# EAGLE design fonte-1 (EAGLE 6.4)
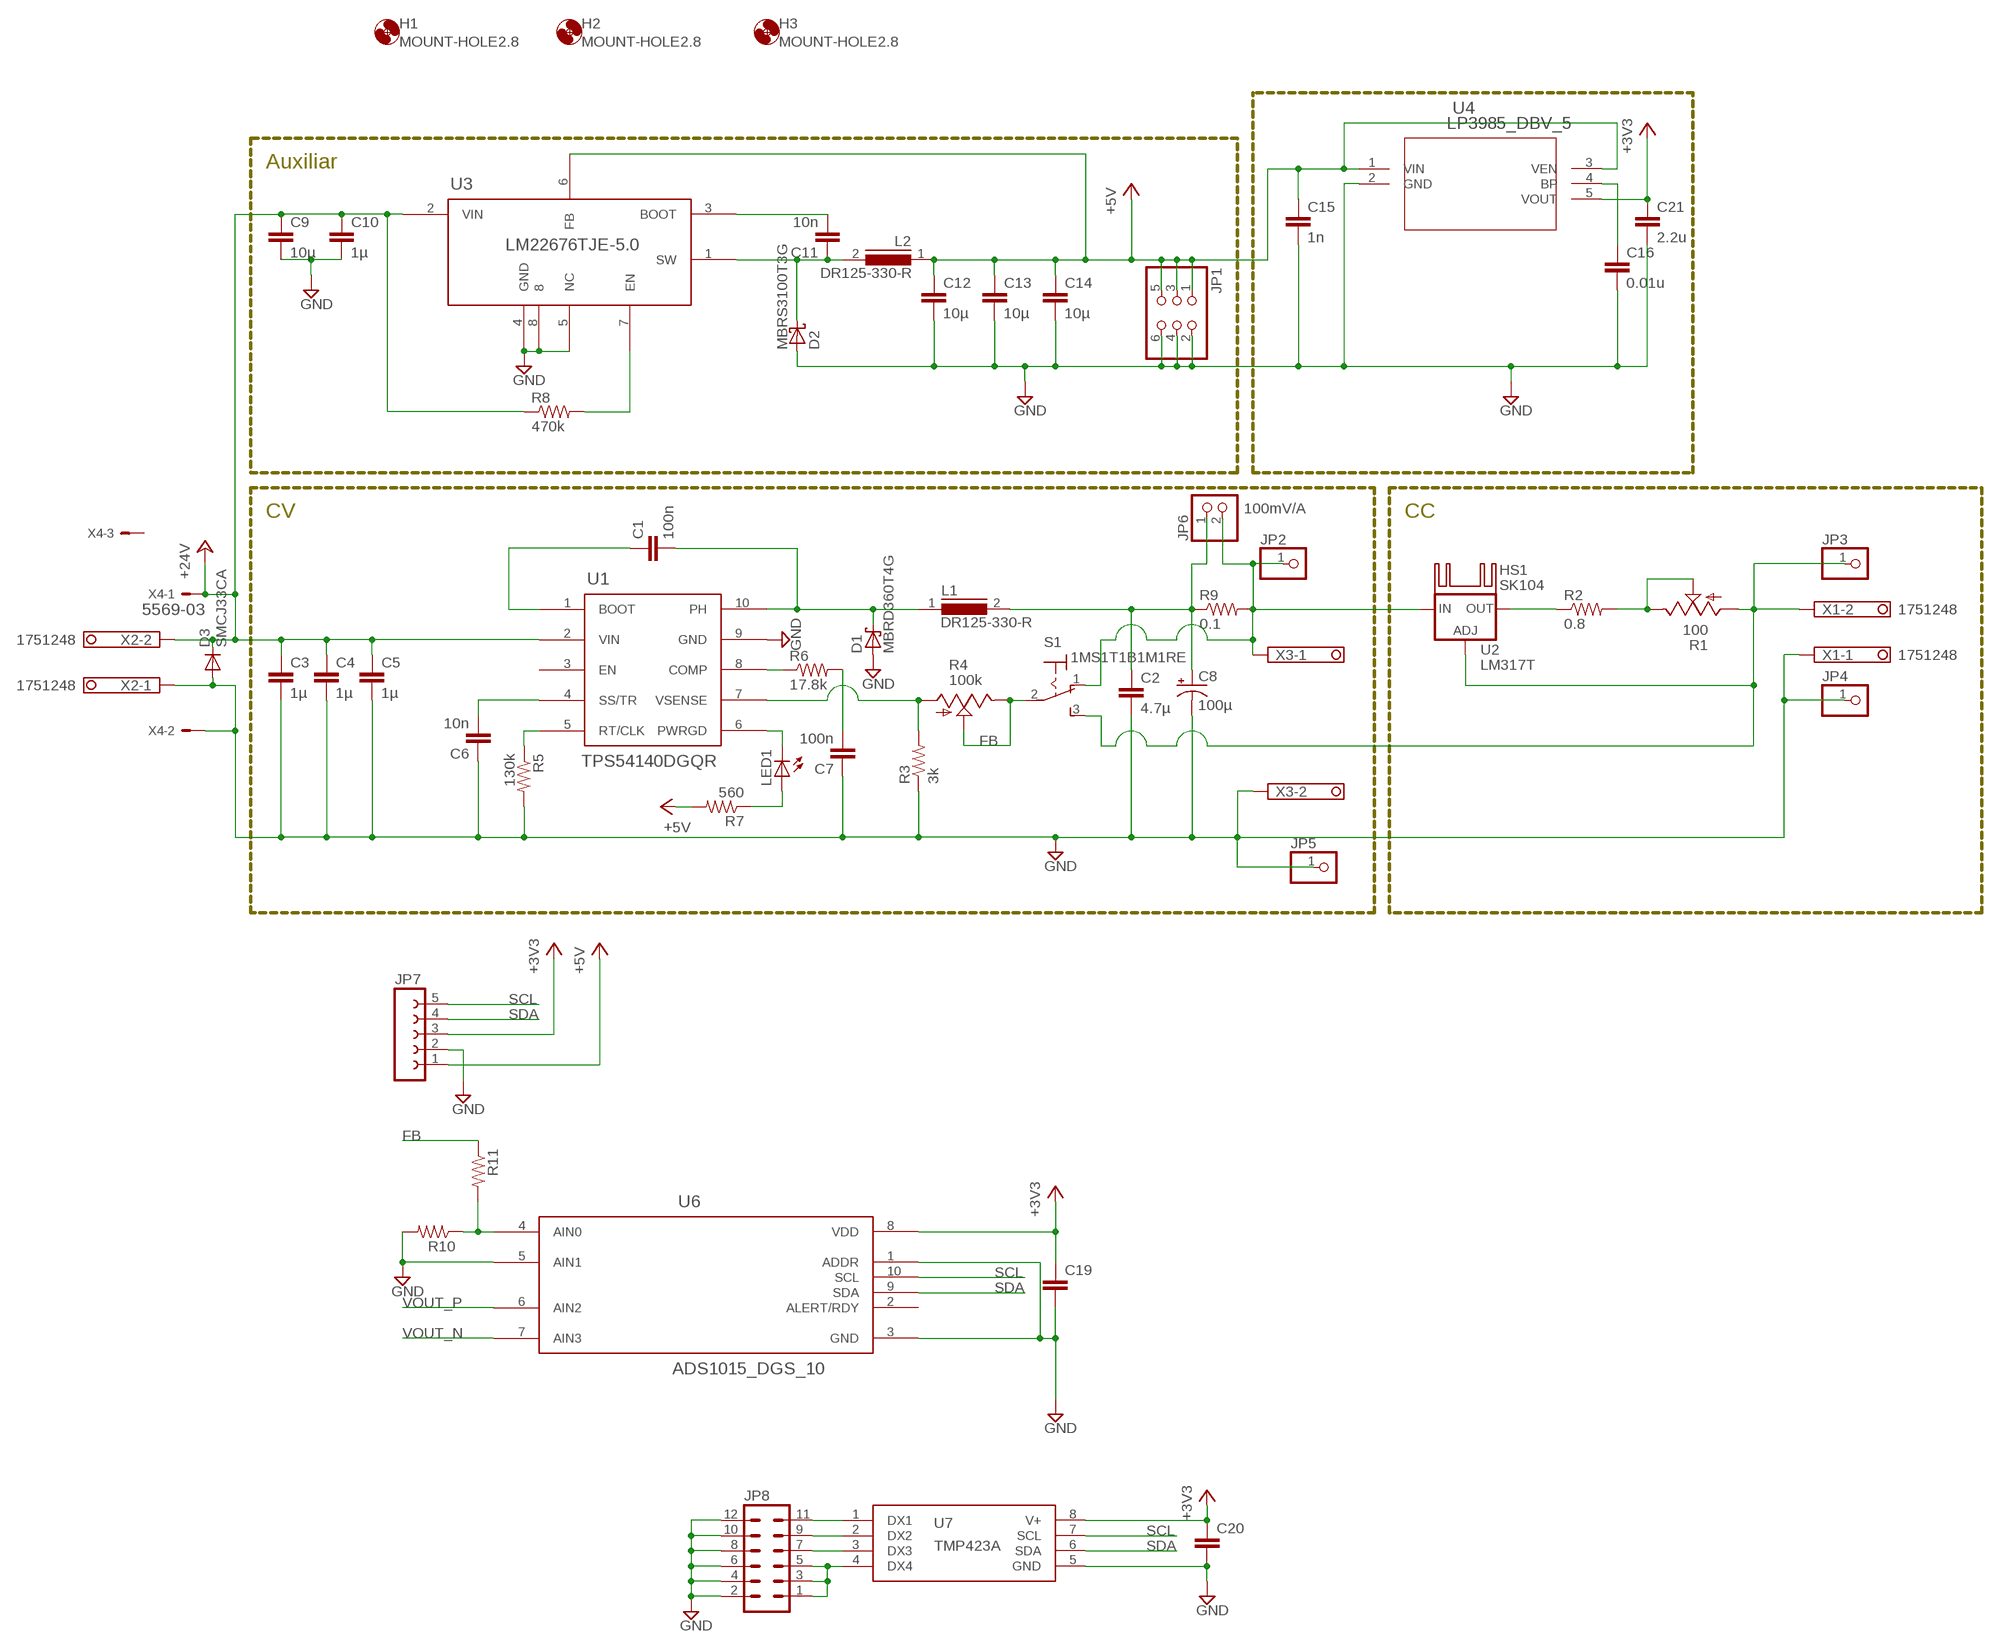
[diagram p0: schematic, sheet 1]

## Parts
C1  100n  C-EUC0805  [C0805]
C2  4.7µ  C-EUC1210  [C1210]
C3  1µ  C-EUC1206  [C1206]
C4  1µ  C-EUC1206  [C1206]
C5  1µ  C-EUC1206  [C1206]
C6  10n  C-EUC0805  [C0805]
C7  100n  C-EUC0805  [C0805]
C8  100µ  CPOL-USUD-8X10  [UD-8X10_NICHICON]
C9  10µ  C-EUC2220K  [C2220K]
C10  1µ  C-EUC1206  [C1206]
C11  10n  C-EUC0805  [C0805]
C12  10µ  C-EUC1206  [C1206]
C13  10µ  C-EUC1206  [C1206]
C14  10µ  C-EUC1206  [C1206]
C15  1n  C-EUC0805  [C0805]
C16  0.01u  C-EUC0805  [C0805]
C19  C-EUC0805  [C0805]
C20  C-EUC1206  [C1206]
C21  2.2u  C-EUC0805  [C0805]
D1  MBRD360T4G  [DPACK_1]
D2  MBRS3100T3G  SCHOTTKY-DIODESMC  [SMC]
D3  SMCJ33CA  DIODE-SMC  [SMC]
H1  MOUNT-HOLE2.8  [2,8]
H2  MOUNT-HOLE2.8  [2,8]
H3  MOUNT-HOLE2.8  [2,8]
HS1  SK104  [SK104]
JP1  PINHD-2X3  [2X03]
JP2  PINHD-1X1  [1X01]
JP3  PINHD-1X1  [1X01]
JP4  PINHD-1X1  [1X01]
JP5  PINHD-1X1  [1X01]
JP6  100mV/A  PINHD-1X2  [1X02]
JP7  FE05-1  [FE05-1]
JP8  MA06-2  [MA06-2]
L1  DR125-330-R  DR125  [DR125]
L2  DR125-330-R  DR125  [DR125]
LED1  LED5MM  [LED5MM]
R1  100  TRIM_US-  [1X03]
R2  0.8  R-US_R2512  [R2512]
R3  3k  R-US_R0805  [R0805]
R4  100k  TRIM_US-  [1X03]
R5  130k  R-US_R0805  [R0805]
R6  17.8k  R-US_R0805  [R0805]
R7  560  R-US_R0805  [R0805]
R8  470k  R-US_R0805  [R0805]
R9  0.1  R-US_R2010  [R2010]
R10  R-US_R0805  [R0805]
R11  R-US_R0805  [R0805]
S1  1MS1T1B1M1RE  M9040P  [M9040P]
U1  TPS54140DGQR  TPS54140_DGQ_10  [DGQ10_1P88X1P57]
U2  LM317T  LM317TS  [317TS]
U3  LM22676TJE-5.0  LM22678_NDR_7  [TJ7A]
U4  LP3985_DBV_5  [MF05A]
U6  ADS1015_DGS_10  [DGS10]
U7  TMP423A  TMP422AIDC*  [SOT23-8]
X1  1751248  [1751248]
X2  1751248  [1751248]
X3  1751248  [1751248]
X4  5569-03  [5569-03]

## Nets
+3V3: C19.1 C20.1 C21.1 JP7.3 U4.5(VOUT) U6.8(VDD) U7.8(V+)
+5V: C12.1 C13.1 C14.1 C15.1 JP1.1 JP1.3 JP1.5 JP7.1 L2.1 R7.2 U3.6(FB) U4.1(VIN) U4.3(VEN)
+24V: C3.1 C4.1 C5.1 C9.1 C10.1 D3.C R8.1 U1.2(VIN) U3.2(VIN) X2.2 X4.1
FB [+24V]: R4.2(S) R4.3(E) R11.1 S1.2(P)
GND: C2.2 C3.2 C4.2 C5.2 C6.1 C7.1 C8.- C9.2 C10.2 C12.2 C13.2 C14.2 C15.2 C16.2 C19.2 C20.2 C21.2 D1.A1(A) D1.A2(A) D2.A D3.A JP1.2 JP1.4 JP1.6 JP4.1 JP5.1 JP7.2 JP8.2 JP8.4 JP8.6 JP8.8 JP8.10 JP8.12 R3.1 R5.2 R10.2 U1.9(GND) U3.4(GND) U3.5(NC) U3.8 U4.2(GND) U6.1(ADDR) U6.3(GND) U6.5(AIN1) U7.5(GND) X1.1 X2.1 X3.2 X4.2
N$1: C1.2 D1.K(C) L1.1 U1.10(PH)
N$2: C1.1 U1.1(BOOT)
N$3 [+24V]: R1.2(S) R1.3(E) R2.2
N$4: R8.2 U3.7(EN)
N$5: R10.1 R11.2 U6.4(AIN0)
N$6 [+24V]: R2.1 U2.2(OUT)
N$7: R3.2 R4.1(A) U1.7(VSENSE)
N$8: JP8.1 JP8.3 JP8.5 U7.4(DX4)
N$9: R5.1 U1.5(RT/CLK)
N$10: C6.2 U1.4(SS/TR)
N$11: R6.1 U1.8(COMP)
N$12: C7.2 R6.2
N$13: LED1.K(C) U1.6(PWRGD)
N$14: LED1.A R7.1
N$15: C16.1 U4.4(BP)
N$16: C11.1 D2.C L2.2 U3.1(SW)
N$17: JP8.7 U7.3(DX3)
N$18: C11.2 U3.3(BOOT)
N$19: JP8.9 U7.2(DX2)
N$20: JP8.11 U7.1(DX1)
SCL: JP7.5 U6.10(SCL) U7.7(SCL)
SDA: JP7.4 U6.9(SDA) U7.6(SDA)
VOUT_CC [+24V]: JP3.1 R1.1(A) S1.3(S) U2.1(ADJ) X1.2
VOUT_N [+24V]: JP2.1 JP6.2 R9.2 S1.1(O) U2.3(IN) U6.7(AIN3) X3.1
VOUT_P [+24V]: C2.1 C8.+ JP6.1 L1.2 R9.1 U6.6(AIN2)
Unconnected: U1.3(EN) U6.2(ALERT/RDY) X4.3

## Notes on the sheet
- Auxiliar
- CV | CC

## Library data of the parts
C1-C7 C9-C16 C19-C21 = rcl:C-EU: CAPACITOR, European symbol
C8 = rcl:CPOL-US: POLARIZED CAPACITOR, American symbol
D1 = diode:MBRD360T4G
D2 = diode:SCHOTTKY-DIODE: Schottky Diode
D3 = diode:DIODE-: DIODE
H1-H3 = holes:MOUNT-HOLE: MOUNTING HOLE with drill center marker
HS1 = heatsink:SK104: HEATSINK manufacturer Fischer/distributor Buerklin
JP1 = pinhead:PINHD-2X3: PIN HEADER
JP2-JP5 = pinhead:PINHD-1X1: PIN HEADER
JP6 = pinhead:PINHD-1X2: PIN HEADER
JP7 = con-lsta:FE05-1: FEMALE HEADER; OC_FARNELL: unknown; OC_NEWARK: unknown
JP8 = con-lstb:MA06-2: PIN HEADER; OC_FARNELL: unknown; OC_NEWARK: unknown
L1 L2 = inductors:DR125: High Power Density, High Efficiency, Shielded Inductors Source: coiltronics_dr_series.pdf
LED1 = led:LED: LED OSRAM: - CHIPLED LG R971, LG N971, LY N971, LG Q971, LY Q971, LO R971, LY R971 LH N974, LH R974 LS Q976, LO Q976, LY Q976 LO Q996 - Hyper CHIPLED LW Q18S LB Q993, LB Q99A, LB R99A - SideLED LS A670, LO A670, LY A670, LG A670, LP A670 LB A673, LV A673, LT A673, LW A673 LH A674 LY A675 LS A676, LA A676, LO A676, LY A676, LW A676 LS A679, LY A679, LG A679 - Hyper Micro SIDELED® LS Y876, LA Y876, LO Y876, LY Y876 LT Y87S - SmartLED LW L88C, LW L88S LB L89C, LB L89S, LG L890 LS L89K, LO L89K, LY L89K LS L896, LA L896, LO L896, LY L896 - TOPLED LS T670, LO T670, LY T670, LG T670, LP T670 LSG T670, LSP T670, LSY T670, LOP T670, LYG T670 LG T671, LOG T671, LSG T671 LB T673, LV T673, LT T673, LW T673 LH T674 LS T676, LA T676, LO T676, LY T676, LB T676, LH T676, LSB T676, LW T676 LB T67C, LV T67C, LT T67C, LS T67K, LO T67K, LY T67K, LW E67C LS E67B, LA E67B, LO E67B, LY E67B, LB E67C, LV E67C, LT E67C LW T67C LS T679, LY T679, LG T679 LS T770, LO T770, LY T770, LG T770, LP T770 LB T773, LV T773, LT T773, LW T773 LH T774 LS E675, LA E675, LY E675, LS T675 LS T776, LA T776, LO T776, LY T776, LB T776 LHGB T686 LT T68C, LB T68C - Hyper Mini TOPLED® LB M676 - Mini TOPLED Santana® LG M470 LS M47K, LO M47K, LY M47K Source: http://www.osram.convergy.de LUXEON: - LUMILED® LXK2-PW12-R00, LXK2-PW12-S00, LXK2-PW14-U00, LXK2-PW14-V00 LXK2-PM12-R00, LXK2-PM12-S00, LXK2-PM14-U00 LXK2-PE12-Q00, LXK2-PE12-R00, LXK2-PE12-S00, LXK2-PE14-T00, LXK2-PE14-U00 LXK2-PB12-K00, LXK2-PB12-L00, LXK2-PB12-M00, LXK2-PB14-N00, LXK2-PB14-P00, LXK2-PB14-Q00 LXK2-PR12-L00, LXK2-PR12-M00, LXK2-PR14-Q00, LXK2-PR14-R00 LXK2-PD12-Q00, LXK2-PD12-R00, LXK2-PD12-S00 LXK2-PH12-R00, LXK2-PH12-S00 LXK2-PL12-P00, LXK2-PL12-Q00, LXK2-PL12-R00 Source: www.luxeon.com KINGBRIGHT: KA-3528ASYC Source: www.kingbright.com
R1 R4 = pot_header:TRIM_US-: POTENTIOMETER
R2 R3 R5-R11 = rcl:R-US_: RESISTOR, American symbol
S1 = switch:M9040P: TOGGLE SWITCH Marquardt
U1 = TPS54140:TPS54140_DGQ_10; DATASHEETURL: http://www.ti.com/lit/gpn/TPS54140; DESCRIPTION: 3.5V to 42V Input, 1.5A Step-Down Converter with Eco-Mode; FAMILY_NAME: STEP-DOWN REGULATOR; GENERIC_PART_NUMBER: TPS54140; INDUSTRY_STD_PKG_TYPE: MSOP-PowerPAD; MANUFACTURER: Texas Instruments; MANUFACTURER_PART_NUMBER: tps54140_dgq_10; PACKAGE_DESIGNATOR: DGQ; PIN_COUNT: 10; VENDOR: Texas Instruments
U2 = v-reg:LM317TS: VOLTAGE REGULATOR
U3 = LM22678:LM22678_NDR_7; BASEPN: LM22678; DATASHEETURL: http://www.ti.com/lit/ds/symlink/lm22678.pdf; DESCRIPTION: 5A SIMPLE SWITCHER®, Step-Down Voltage Regulator with Precision Enable; MANUFACTURER: Texas Instruments; MANUFACTURER_PART_NUMBER: lm22678_ndr_7; NSC_PACKAGEREFERENCE: TJ7A; VENDOR: Texas Instruments
U4 = LP3985:LP3985_DBV_5; BASE_PN: LP3985; COMP: TypeLDO; LIBRARY: ReferenceLP3985IM5; PARTNUMBER: LP3985IM5-25; PIN: Count5; SYMBOL: NameLP3985IM5-25; TYPE: LP3985IM5-2.5; VENDOR: NationalSemiconductor; VERSION: 1
U6 = ADS1015:ADS1015_DGS_10; DATASHEETURL: http://www.ti.com/lit/gpn/ADS1015; DESCRIPTION: 12-Bit ADC with Integrated MUX, PGA, Comparator, Oscillator, and Reference; FAMILY_NAME: PRECISION ADC (<=10MSPS); GENERIC_PART_NUMBER: ADS1015; INDUSTRY_STD_PKG_TYPE: MSOP; MANUFACTURER: Texas Instruments; PACKAGE_DESIGNATOR: DGS; PIN_COUNT: 10
U7 = texas-1:TMP422
X1-X3 = con-phoenix-350:1751248: MKDS 1/ 2-3,5 Printklemme Nennstrom: 10 A Bemessungsspannung: 160 V Raster: 3,5 mm Polzahl: 2 Montageart: Löten Anschlussart: Schraubanschluss Anschlussrichtung vom Leiter zur Platine: 0° Source: http://eshop.phoenixcontact.com .. 1751248.pdf; OC_FARNELL: unknown; OC_NEWARK: unknown
X4 = con-molex-5569:5569-03

## Net classes
1 +24V: clearance 0.762 mm

## Board
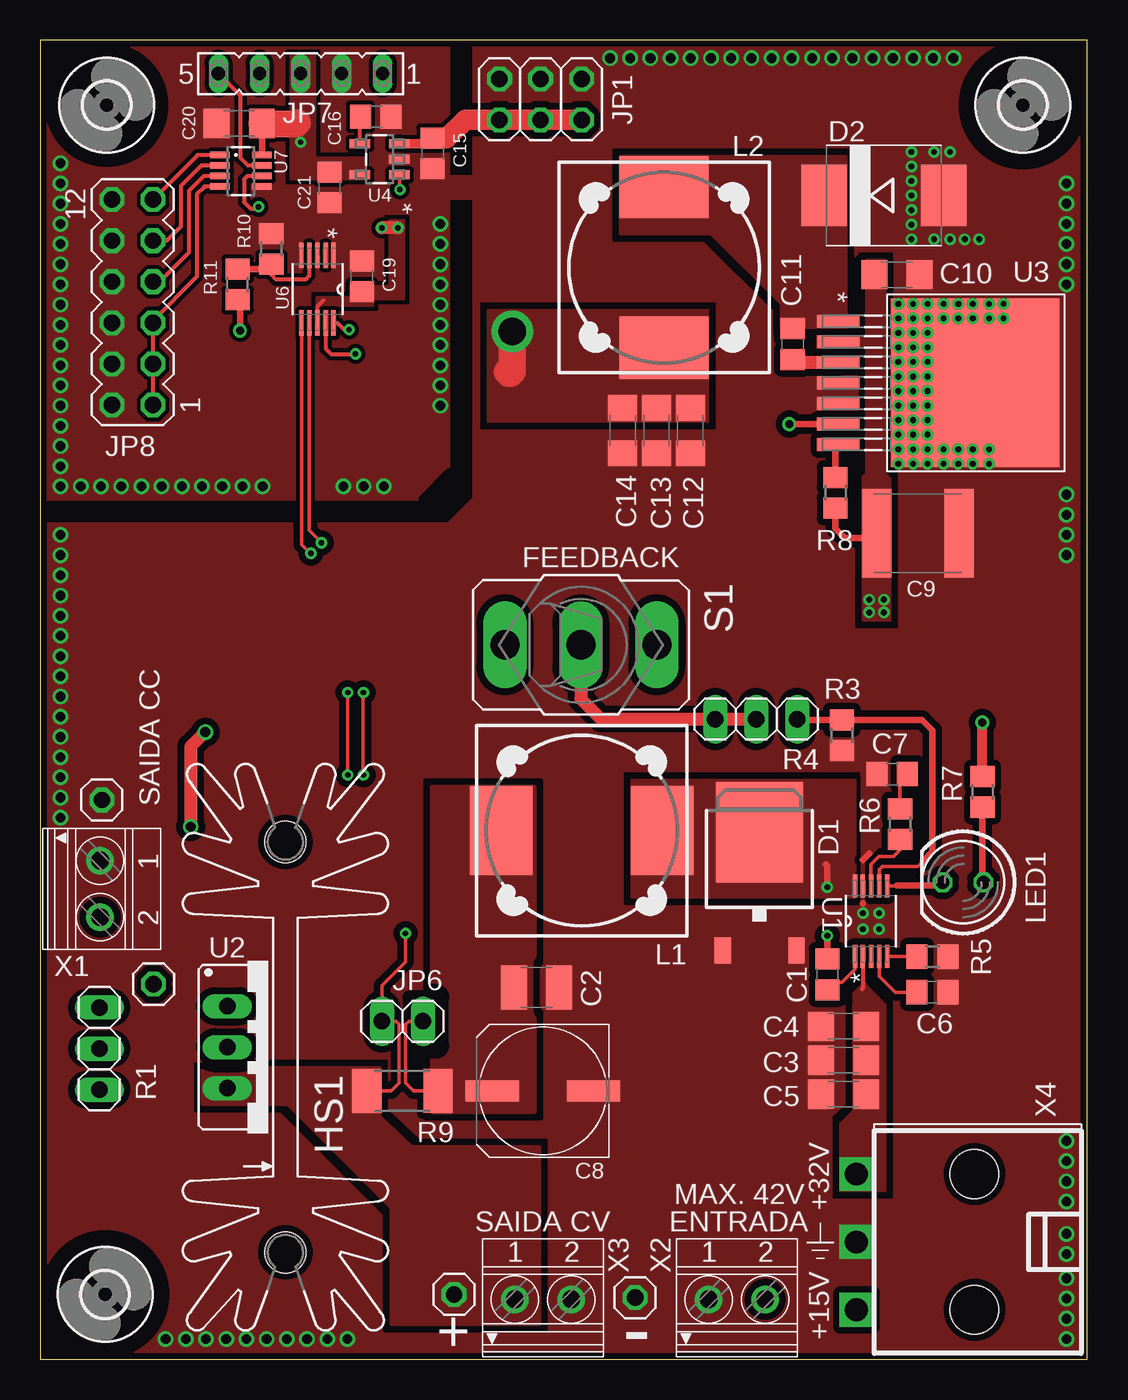
[diagram p1: board, top side]
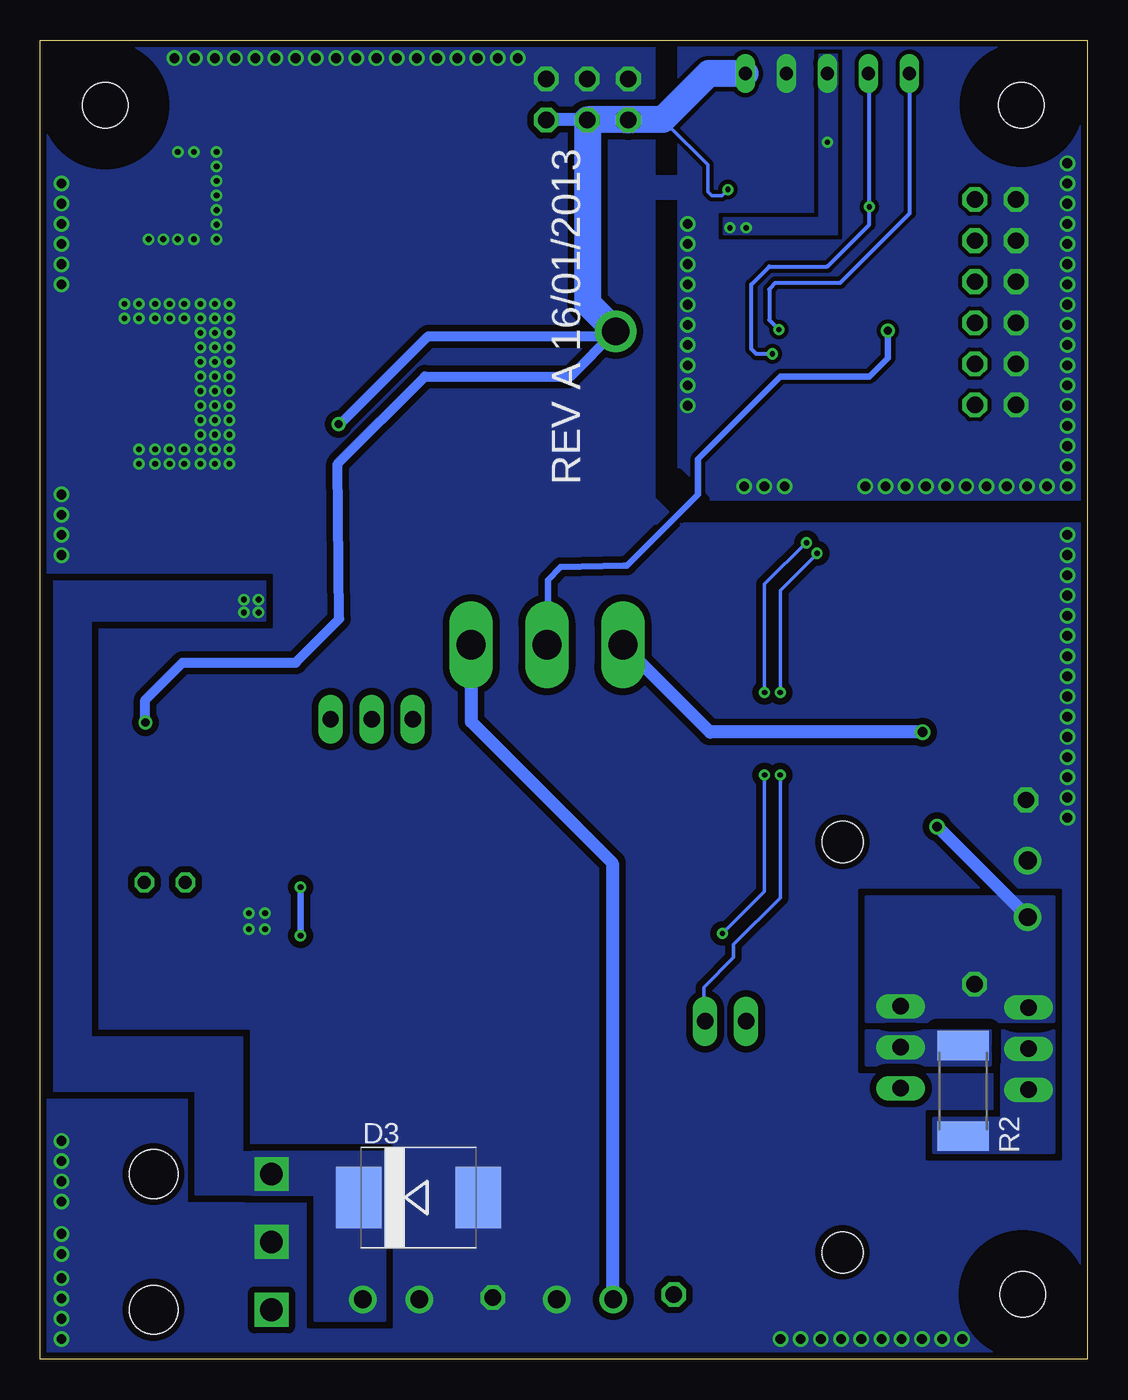
[diagram p2: board, bottom side, seen from below]

Size 64.8 x 81.6 mm. Coordinates in mm from the lower left corner, seen from the top.
Outline: 0,0 64.8,0 64.8,81.6 0,81.6 0,0
Copper layers (1*16): Top 0.0356mm / dielectric 1.5011mm / Bottom 0.0356mm
Design rules "LaenPCBOrder *": minimum track width 6mil, minimum drill 13mil, track to track 6mil, track to pad 6mil, pad to pad 6mil, via to via 6mil, smd to smd 6mil, copper to edge 15mil, drill to drill 6mil, minimum pad ring 7mil, minimum via ring 7mil, stop-mask expansion 8mil, vias tented up to drill 0mil, thermal gap 10mil
tRestrict: area 22.8,19.4 to 24.5,22.4; area 23.7,53.2 to 25.3,54.8
bRestrict: area 23.7,53.2 to 25.3,54.8

### Footprints (pad centres in the part's own frame; a part is rotated, then mirrored left to right if it is on the bottom)
C0805 = smd 1.3 x 1.5: 1 -0.95,0; 2 0.95,0
C1210 = smd 1.6 x 2.7: 1 -1.4,0; 2 1.4,0
C1206 = smd 1.6 x 1.8: 1 -1.4,0; 2 1.4,0
UD-8X10_NICHICON = smd 3.3 x 1.3: + 3.125,0; - -3.125,0
C2220K = smd 1.85 x 5.5: 1 -2.55,0; 2 2.55,0
DPACK_1 = smd 1 x 1.6: A1 -2.28,-4.8; A2 2.28,-4.8 | smd 5.4 x 6.2: K 0,2.5
SMC = smd 2.8 x 3.8: A 3.7,0; C -3.7,0
2,8 = hole 2.8: 0,0
SK104 = hole 2.54: -12.7,-0.762; 12.7,-0.762
2X03 = drill 1.016 octagon: 1 -2.54,-1.27; 2 -2.54,1.27; 3 0,-1.27; 4 0,1.27; 5 2.54,-1.27; 6 2.54,1.27
1X01 = drill 1.016 octagon: 1 0,0
1X02 = drill 1.016 long: 1 -1.27,0; 2 1.27,0
FE05-1 = drill 0.813 long: 1 -5.08,0; 2 -2.54,0; 3 0,0; 4 2.54,0; 5 5.08,0
MA06-2 = drill 1.016 octagon: 1 -6.35,-1.27; 2 -6.35,1.27; 3 -3.81,-1.27; 4 -3.81,1.27; 5 -1.27,-1.27; 6 -1.27,1.27; 7 1.27,-1.27; 8 1.27,1.27; 9 3.81,-1.27; 10 3.81,1.27; 11 6.35,-1.27; 12 6.35,1.27
DR125 = smd 3.85 x 5.5: 1 -4.975,0; 2 4.975,0
LED5MM = drill 0.813 octagon: A -1.27,0; K 1.27,0
1X03 = drill 1.016 long: 1 -2.54,0; 2 0,0; 3 2.54,0
R2512 = smd 1.8 x 3.2: 1 -2.8,0; 2 2.8,0
R0805 = smd 1.3 x 1.5: 1 -0.95,0; 2 0.95,0
R2010 = smd 1.8 x 2.7: 1 -2.2,0; 2 2.2,0
M9040P = drill 1.803 long: 1 0,4.699; 2 0,0; 3 0,-4.699
DGQ10_1P88X1P57 = smd 1.422 x 0.279: 1 -2.184,0.991; 2 -2.184,0.508; 3 -2.184,0; 4 -2.184,-0.508; 5 -2.184,-0.991; 6 2.184,-0.991; 7 2.184,-0.508; 8 2.184,0; 9 2.184,0.508; 10 2.184,0.991
317TS = drill 1.016 long: 1 -2.54,-2.54; 2 0,-2.54; 3 2.54,-2.54
TJ7A = smd 0.787 x 2.616: 1 -3.81,-8.331; 2 -2.54,-8.331; 3 -1.27,-8.331; 4 0,-8.331; 5 1.27,-8.331; 6 2.54,-8.331; 7 3.81,-8.331 | smd 10.414 x 10.414: 8 0,0.152
MF05A = smd 1.27 x 0.559: 1 -1.219,0.965; 2 -1.219,0; 3 -1.219,-0.965; 4 1.219,-0.965; 5 1.219,0.965
DGS10 = smd 1.575 x 0.279: 1 -2.083,0.991; 2 -2.083,0.508; 3 -2.083,0; 4 -2.083,-0.508; 5 -2.083,-0.991; 6 2.083,-0.991; 7 2.083,-0.508; 8 2.083,0; 9 2.083,0.508; 10 2.083,0.991
SOT23-8 = smd 0.4 x 1.2: 1 -0.975,-1.3; 2 -0.325,-1.3; 3 0.325,-1.3; 4 0.975,-1.3; 5 0.975,1.3; 6 0.325,1.3; 7 -0.325,1.3; 8 -0.975,1.3
1751248 = drill 1.1 pad 1.7: 1 -1.75,-0.1; 2 1.75,-0.1
5569-03 = drill 1.4 square: 1 4.45,7; 2 0.25,7; 3 -3.95,7 | hole 3: 4.45,-0.3; -3.95,-0.3

### Placement (x,y rotation side)
C1  48.7,23.8 90 top
C2  30.7,23 0 top
C3  49.7,18.5 180 top
C4  49.7,20.6 180 top
C5  49.7,16.4 180 top
C6  55.2,22.7 180 top
C7  52.7,36.2 0 top
C8  31.1,16.6 180 top
C9  54.3,51.1 0 top
C10  53,67.1 0 top
C11  46.55,62.8 270 top
C12  40.23,57.45 270 top
C13  38.12,57.45 270 top
C14  36.02,57.45 270 top
C15  24.27,74.6 270 top
C16  20.75,76.88 0 top
C19  19.9,67 90 top
C20  12.31,76.46 180 top
C21  17.9,72.5 270 top
D1  44.5,30.1 0 top
D2  52.2,72 0 top
D3  41.4,10 0 bottom
H1  4,4 0 top
H2  4.1,77.6 0 top
H3  60.8,77.6 0 top
HS1  14.4,19.3 90 top
JP1  30.95,77.95 0 top
JP2  25.6,4 0 top
JP3  7,23.2 0 top
JP4  3.8,34.6 0 top
JP5  36.8,3.8 0 top
JP6  22.4,20.9 180 top
JP7  16.1,79.55 180 top
JP8  5.7,65.4 90 top
L1  33.5,32.7 180 top
L2  38.6,67.55 90 top
LED1  57.1,29.5 180 top
R1  3.65,19.21 270 top
R2  7.7,16.6 270 bottom
R3  49.6,38.6 90 top
R4  44.3,39.6 180 top
R5  55.2,24.9 0 top
R6  53.2,33.1 90 top
R7  58.3,35.1 90 top
R8  49.2,53.6 90 top
R9  22.4,16.6 180 top
R10  14.3,68.7 90 top
R11  12.2,66.5 90 top
S1  33.45,44.2 270 top
U1  51.4,27.1 90 top
U2  14.1,19.3 270 top
U3  57.7,60.4 270 top
U4  21,74.25 180 top
U6  17.15,66.2 270 top
U7  12.41,73.53 270 top
U$1  [GND]  47.4,6.2 0 top
X1  3.8,29.1 270 top
X2  43.1,3.8 0 top
X3  31.1,3.8 0 top
X4  57.5,7 90 top

### Tracks (layer width: path | path; a pad name or v marks a point on that pad's centre or on a via)
+3V3  (via drill 0.33)
  Top 0.254: U6.8 17.15,65.15 17.5,65.5
  Top 0.406: U7.8 13.71,75.97 14.2,76.46
  Top 0.8: v22.12,70 v21.12,70
  Top 1.676: C20.1 14.2,76.46 15.86,76.46 15.9,76.5
  other vias: 16.1,75.3
  pour Top (isolate 0.254, no thermals): 20,73.03 15.5,73.03 15.5,74.35 20,74.35
  pour Bottom (isolate 0.254, no thermals): 16.6,80.7 16.6,70.6 22.5,70.6 22.5,69.62 15.5,69.62 15.5,80.7
  pour Top (isolate 0.254, no thermals): 19.2,66.4 21.6,66.4 21.6,70.47 22.5,70.47 22.5,65.6 19.2,65.6
  pour Top (isolate 0.254, no thermals): 15.5,74.35 17,74.35 17,80.7 15.5,80.7
  pour Top (isolate 0.254, no thermals): 20.6,65.2 17.1,65.2 17.1,65.7 20.6,65.7
+5V  (via drill 0.33, 0.5, 1.7)
  Top 0.203: U4.1 22.22,72.41 v22.25,72.38
  Top 0.406: U3.6 v46.34,57.86
  Top 0.6: U4.3 23.94,75.22 C15.1
  Top 0.61: R7.2 v58.3,39.4
  Top 0.813: v29.2,63.6 29.5,63.3
  Top 1.27: C15.1 25.15,75.55 26.3,76.7 33.47,76.7 JP1.5
  Top 1.676: v29.2,63.6 29.2,61.1 29.1,61 29,61 28.9,61.1
  Bottom 0.203: v22.25,72.38 22.62,72 23.25,72 23.5,72.25 23.5,73.9 25.99,76.39 26.06,76.39 26.38,76.7
  Bottom 0.406: 29.9,62.9 v29.2,63.6
  Bottom 0.61: v58.3,39.4 58.3,40.8 56,43.1 49,43.1 46.3,45.8 46.4,55.4 41,60.8 32,60.8 v29.2,63.6 29.5,63.3 40.8,63.3 46.24,57.86 v46.34,57.86
  Bottom 0.8: JP1.3 JP1.5
  Bottom 1.676: v29.2,63.6 30.95,65.35 JP1.3 JP1.1 28.39,76.7 26.38,76.7 26.3,76.7 23.45,79.55 JP7.1
  pour Top (isolate 0.254, no thermals): 27.7,58 41.3,58 41.3,64.9 27.7,64.9
+24V  (via drill 0.36)
  Top 0.24: U1.2 50.89,22.94 50.85,22.9
  Top 0.406: R8.1 49.2,51.4 49.8,50.8 51.45,50.8 C9.1
  other vias: 51.3,47 52.2,47 51.3,46.2 52.2,46.2
  pour Bottom (isolate 0.8, no thermals): 47.8,2.4 47.8,10.2 51.7,10.2 51.7,12.8 43.5,12.8 43.5,2.4
  pour Top (isolate 0.8, no thermals): 50.8,25.5 50.8,24 50.3,23.5 50.3,15.4 49.5,14.6 49.5,10.4 52.3,10.4 52.3,22.2 51,24 51,25.5
  pour Top (isolate 0.254, no thermals): 48.1,63.3 51.1,63.3 51.1,68 52.3,68 52.3,54.8 51.1,54.8 51.1,62.6 48.1,62.6
  pour Top (no thermals): 51.1,54.8 52.3,54.8 52.6,54.5 52.6,45.7 50.9,45.7 50.9,54.6
  pour Bottom (isolate 0.8, no thermals): 49.5,10.2 55.2,10.2 55.2,16.6 64.8,16.6 64.8,48.1 50.9,48.1 50.9,45.7 61.7,45.7 61.7,19.9 52.3,19.9 52.3,12.8 49.5,12.8
FB  (via drill 0.5)
  Top 0.406: v12.35,63.65 12.35,65.4 R11.1
  Top 0.813: S1.2 33.45,40.85 34.7,39.6 R4.3 R4.2
  Bottom 0.406: v12.35,63.65 12.35,61.95 13.5,60.8 19,60.8 24.1,55.7 24.1,53.5 28.5,49.1 28.7,49.1 32.6,49 33.4,48.2 33.4,44.25 S1.2
GND  (via drill 0.36, 0.6)
  Top 0.406: 50.89,28.21 50.9,28.2 | 50.9,30.9 51.3,31.3
  other vias: 53.9,73.8 53.9,72.9 53.9,72 53.9,71.1 53.9,70.2 53.9,74.7 55.3,74.7 56.3,74.7 53.9,69.3 55.3,69.3 56.3,69.3 57.2,69.3 58.1,69.3 53.1,65.3 53.1,64.4 54,65.3 54,64.4 54.9,65.3 54.9,64.4 55.9,65.3 56.8,65.3 57.7,65.3 55.9,64.4 56.8,64.4 57.7,64.4 58.7,65.3 58.7,64.4 59.6,65.3 59.6,64.4 53.1,62.6 53.1,61.7 54,62.6 54,61.7 54.9,62.6 54.9,61.7 53.1,59.9 53.1,59 54,59.9 54,59 54.9,59.9 54.9,59 53.1,60.8 54,60.8 54.9,60.8 58.7,56.3 53.1,57.2 53.1,56.3 54,57.2 54,56.3 54.9,57.2 54.9,56.3 55.9,56.3 55.9,55.4 56.8,56.3 56.8,55.4 57.7,56.3 57.7,55.4 53.1,55.4 54,55.4 54.9,55.4 53.1,58.1 54,58.1 54.9,58.1 58.7,55.4 53.1,63.5 54,63.5 54.9,63.5 50.9,26.6 50.9,27.6 51.9,27.6 51.9,26.6 1.25,51 1.25,49.75 1.25,48.5 1.25,47.25 1.25,46 1.25,44.75 1.25,43.5 1.25,42.25 1.25,41 1.25,39.75 1.25,38.5 1.25,37.25 1.25,36 1.25,34.75 1.25,33.5 7.75,1.25 9,1.25 10.25,1.25 11.5,1.25 12.75,1.25 14,1.25 15.25,1.25 16.5,1.25 17.75,1.25 19,1.25 63.5,1.25 63.5,2.5 63.5,3.75 63.5,5 63.5,6.5 63.5,7.75 63.5,9.75 63.5,11 63.5,12.25 63.5,13.5 63.5,49.75 63.5,51 63.5,52.25 63.5,53.5 63.5,67.75 63.5,66.5 63.5,69 63.5,70.25 63.5,71.5 63.5,72.75 56.5,80.5 55.25,80.5 54,80.5 52.75,80.5 51.5,80.5 49,80.5 50.25,80.5 47.75,80.5 46.5,80.5 45.25,80.5 44,80.5 42.75,80.5 41.5,80.5 40.25,80.5 39,80.5 37.75,80.5 36.5,80.5 35.25,80.5 1.25,54 1.25,55.25 1.25,56.5 1.25,57.75 1.25,59 1.25,60.25 1.25,61.5 1.25,62.75 1.25,64 1.25,65.25 1.25,66.5 1.25,67.75 1.25,69 1.25,70.25 1.25,71.5 1.25,72.75 1.25,74 2.5,54 3.75,54 5,54 6.25,54 7.5,54 8.75,54 10,54 11.25,54 12.5,54 13.75,54 18.75,54 20,54 21.25,54 24.75,59 24.75,60.25 24.75,61.5 24.75,62.75 24.75,64 24.75,65.25 24.75,66.5 24.75,67.75 24.75,69 24.75,70.25
  pour Top (isolate 0.254, rank 6, no thermals): 50,27.8 52.9,27.8 52.9,28 51,27.9 51,30.8 51.9,31.7 51.9,36.4 50.8,36.4 50.8,27.9 50,27.9
  pour Top (isolate 0.406, rank 6, no thermals): 0,0 64.8,0 64.8,81.6 30,81.6 26.8,81.6 26.8,51.7 0,51.7
  pour Top (isolate 0.254, rank 6, no thermals): 0,53.2 25.3,53.2 25.3,81.6 0,81.6
  pour Top (isolate 0.254, rank 6): 26.8,71.8 26.8,73.2 25.3,73.2 25.3,71.8
  pour Bottom (isolate 0.406, rank 6, no thermals): 0,0 64.8,0 64.8,81.6 30,81.6 26.8,81.6 26.8,51.7 0,51.7
  pour Bottom (isolate 0.254, rank 6, no thermals): 0,53.2 25.3,53.2 25.3,81.6 0,81.6
  pour Bottom (isolate 0.254, rank 6): 26.8,71.8 26.8,73.2 25.3,73.2 25.3,71.8
  pour Bottom (isolate 0.254, rank 6, no thermals): 25.2,51.7 26.8,51.7 26.8,52.8 26.8,53.1 26.8,53.3
  pour Top (isolate 0.254, rank 6, no thermals): 25.2,51.7 26.8,51.7 26.8,52.8 26.8,53.1 26.8,53.3
N$1  (via drill 0.36)
  Top 0.406: C1.2 v48.7,26.2 | v48.7,29.2 48.7,30.5 48.6,30.6
  Bottom 0.406: v48.7,26.2 v48.7,29.2
  pour Top (isolate 0.305, no thermals): 50.4,28.6 36.6,28.6 36.6,35.8 50.4,35.8
N$2
  Top 0.203: 48.7,22.9 C1.1 49.15,23.3 49.6,23.3 50.4,24.1 50.4,24.91 U1.1
N$3
  pour Bottom (isolate 0.254, no thermals): 2.1,20.3 5.3,20.3 5.3,14.9 9.5,14.9 9.5,12.8 2.1,12.8
N$4
  Top 0.406: R8.2 49.2,56.42 U3.7
N$5
  Top 0.254: U6.4 16.64,67.04 16.4,66.8 14.6,66.8 14.3,67.1 R10.1
  Top 0.406: R11.2 14,67.45 R10.1
N$6
  pour Bottom (isolate 0.254, no thermals): 6,20.3 13.7,20.3 13.7,18.2 6,18.2
N$7
  Top 0.203: 54.6,30.8 54.3,30.5 52.1,30.5 51.91,30.31 U1.7
  Top 0.406: 54.6,30.8 55.2,31.4 55.2,38.9 54.55,39.55 R3.2 46.89,39.55 R4.1
N$8
  Top 0.254: JP8.1 JP8.3 JP8.5 6.97,64.27 9.7,67 9.7,72.1 10.15,72.55 U7.4
N$9
  Top 0.203: U1.5 54.23,24.92 R5.1
N$10
  Top 0.203: U1.4 51.91,23.69 52.9,22.7 C6.2
N$11
  Top 0.203: U1.8 51.4,30.6 51.9,31.1 52.8,31.1 53.2,31.5 R6.1
N$12
  Top 0.203: R6.2 53.2,35.75 C7.2
N$13
  Top 0.203: U1.6 52.98,29.28 53,29.3
  Top 0.406: 53,29.3 55.63,29.3 LED1.K
N$14
  Top 0.406: R7.1 58.3,29.57 LED1.A
N$15
  Top 0.254: U4.4 19.78,76.86 C16.1
N$16
  pour Top (isolate 0.254, no thermals): 45.85,63.85 45.85,65.3 41.5,69.65 35.9,69.65 35.9,74.4 49.85,74.4 49.85,70.15 49.85,63.85
N$17
  Top 0.254: JP8.7 7.37,66.67 9.2,68.5 9.2,72.3 10.1,73.2 U7.3
N$18
  Top 0.813: U3.3 46.73,61.67 C11.2
N$19
  Top 0.254: JP8.9 7.81,69.21 8.7,70.1 8.7,72.6 9.95,73.85 U7.2
N$20
  Top 0.254: U7.1 9.72,74.5 JP8.11
SCL  (via drill 0.33)
  Top 0.254: U6.10 18.38,64.12 18.8,63.7 v19.1,63.7 | U7.7 12.85,73.85 12.4,74.3 12.4,78.17 JP7.5
  Bottom 0.254: JP7.5 11,79.53 11,70.9 15.3,66.6 19.3,66.6 19.7,66.2 19.7,64.3 v19.1,63.7
SDA  (via drill 0.33)
  Top 0.254: U6.9 17.66,62.54 18,62.2 v19.5,62.2 | U7.6 12.8,73.2 12.6,73 12.6,71.6 13,71.2 13.4,71.2 v13.5,71.3
  Bottom 0.254: v19.5,62.2 20.5,62.2 20.8,62.5 20.8,66.5 19.7,67.6 16.1,67.6 13.5,70.2 v13.5,71.3 13.5,79.49 JP7.4
VOUT_CC  (via drill 0.6)
  Top 0.813: v9.3,32.95 9.3,37.9 v10.2,38.8
  Bottom 0.813: v9.3,32.95 X1.2 | v10.2,38.8 23.35,38.8 S1.3
  pour Bottom (isolate 0.254, no thermals): 2.1,20.9 13.7,20.9 13.7,28.6 2.1,28.6
VOUT_N  (via drill 0.33)
  Top 0.203: R9.2 21.7,16.6 22.2,17.1 22.2,20.7 22,20.9 JP6.2 21.13,23.13 22.59,24.59 v22.59,26.34 | U6.7 16.64,51.29 17.34,50.59 v17.39,50.51 | v19.98,41.25 v19.98,36.14
  Bottom 0.152: 21.25,21.02 JP6.2
  Bottom 0.203: v17.39,50.51 17.34,50.59 19.98,47.95 v19.98,41.25 | v19.98,36.14 19.98,28.95 v22.59,26.34
  Bottom 0.813: X3.1 29.4,3.75 29.4,30.7 38.15,39.45 S1.1
  pour Top (isolate 0.6, no thermals): 10,17.4 10,15.8 15.3,15.8 21.7,9.4 21.7,2.2 30.9,2.2 30.9,13.1 23,13.1 21,15 21,18 10,18
VOUT_P  (via drill 0.33)
  Top 0.203: R9.1 23.1,16.6 22.6,17.1 22.6,20.7 22.8,20.9 JP6.1 | U6.6 16.16,50.41 16.66,49.91 v16.74,49.86 | v19.02,41.25 v19.02,36.14
  Bottom 0.152: JP6.1 23.67,21.17 23.75,21.25
  Bottom 0.203: v16.74,49.86 16.66,49.91 19.02,47.55 v19.02,41.25 | v19.02,36.14 19.02,28.55 21.91,25.66 21.91,24.84 23.75,23 23.75,21.25
  pour Top (isolate 0.8, no thermals): 30.6,15.3 30.6,35.4 24.2,35.4 24.2,15.3

### Text on the board
tPlace: MAX. 42V | + | -
tNames: FEEDBACK | SAIDA CC | +32V | SAIDA CV | ENTRADA | +15V
bNames: REV A 16/01/2013